# Altium schematic sheet Top.SchDoc
size 406 x 304 mm; SheetNumber: 1; SheetTotal: 10
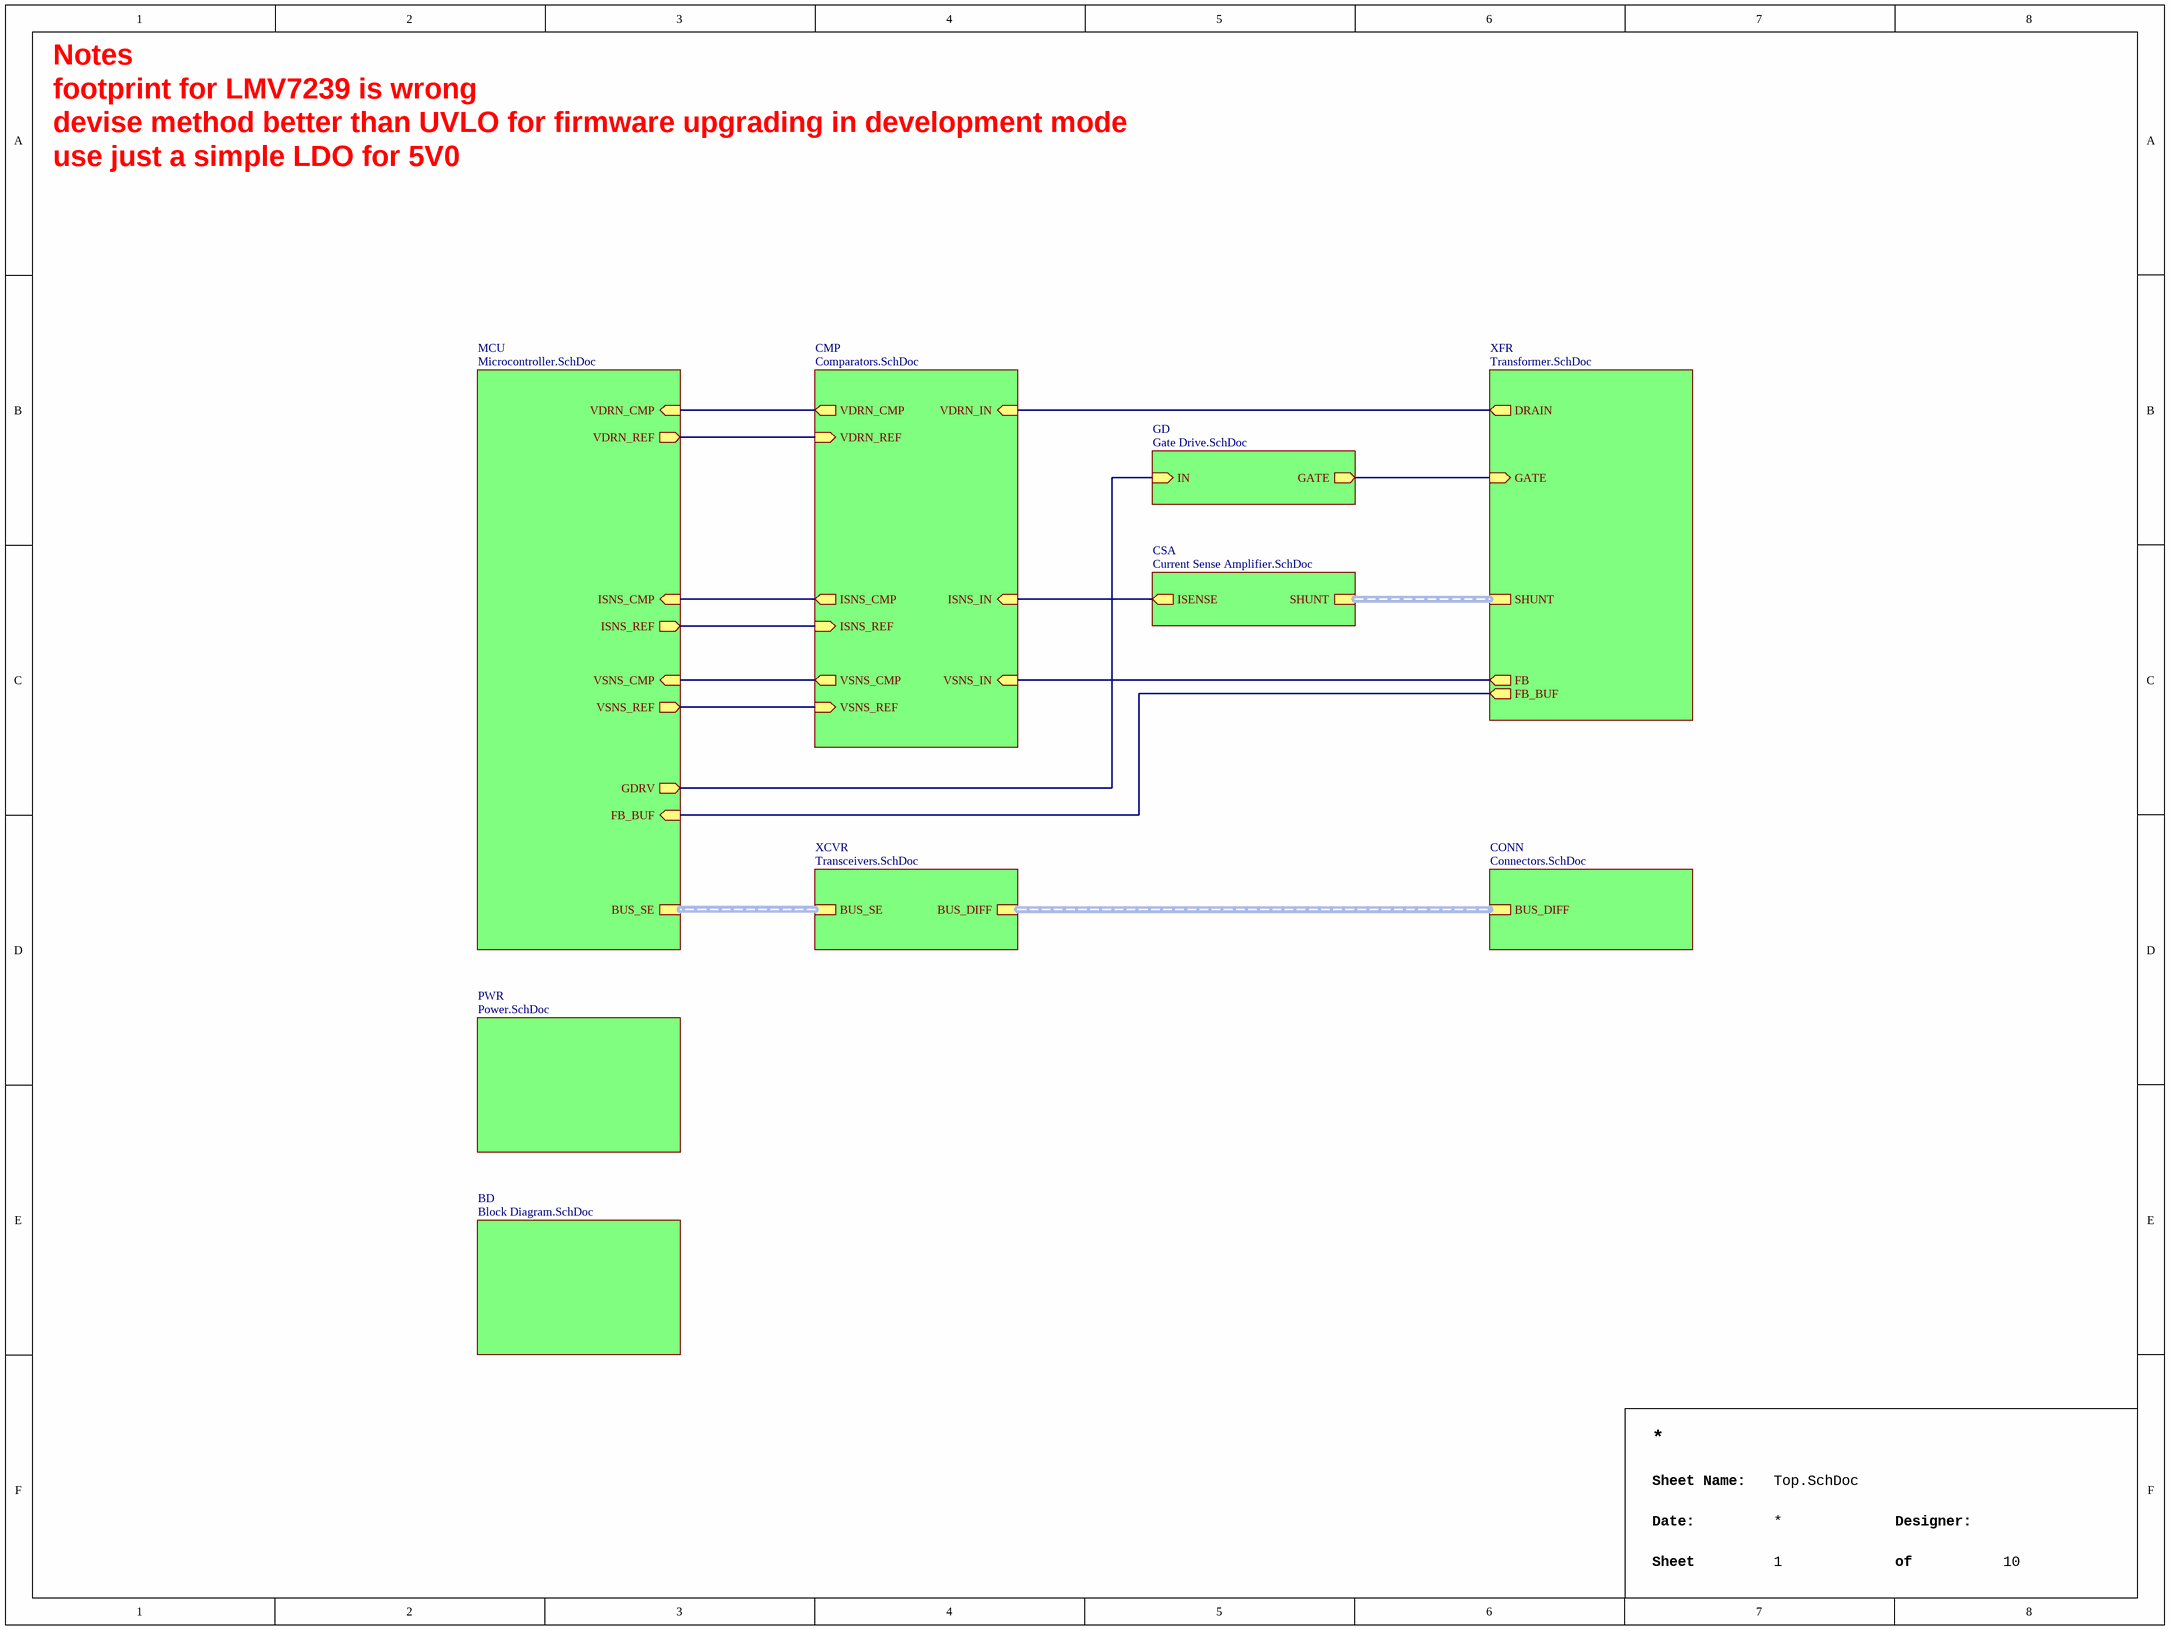
[diagram p0: Top.SchDoc]

## Sub-sheets
BD = Block Diagram.SchDoc: no entries
CMP = Comparators.SchDoc: ISNS_CMP (out), VSNS_CMP (out), VDRN_CMP (out), ISNS_REF (in), ISNS_IN (in), VSNS_REF (in), VSNS_IN (in), VDRN_REF (in), VDRN_IN (in)
CONN = Connectors.SchDoc: BUS_DIFF (harness BUS_DIFF)
CSA = Current Sense Amplifier.SchDoc: SHUNT (harness SHUNT), ISENSE (out)
GD = Gate Drive.SchDoc: GATE (out), IN (in)
MCU = Microcontroller.SchDoc: VDRN_CMP (in), VDRN_REF (out), ISNS_CMP (in), ISNS_REF (out), VSNS_CMP (in), VSNS_REF (out), BUS_SE (harness BUS_SE), GDRV (out), FB_BUF (in)
PWR = Power.SchDoc: no entries
XCVR = Transceivers.SchDoc: BUS_SE (harness BUS_SE), BUS_DIFF (harness BUS_DIFF)
XFR = Transformer.SchDoc: DRAIN (out), GATE (in), FB (out), SHUNT (harness SHUNT), FB_BUF (out)

## Nets
(unnamed): sheet XFR/DRAIN, sheet CMP/VDRN_IN
(unnamed): sheet XFR/GATE, sheet GD/GATE
(unnamed): sheet XFR/FB, sheet CMP/VSNS_IN
(unnamed): sheet XFR/FB_BUF, sheet MCU/FB_BUF
(unnamed): sheet CSA/ISENSE, sheet CMP/ISNS_IN
(unnamed): sheet GD/IN, sheet MCU/GDRV
(unnamed): sheet CMP/ISNS_CMP, sheet MCU/ISNS_CMP
(unnamed): sheet CMP/VSNS_CMP, sheet MCU/VSNS_CMP
(unnamed): sheet CMP/VDRN_CMP, sheet MCU/VDRN_CMP
(unnamed): sheet CMP/ISNS_REF, sheet MCU/ISNS_REF
(unnamed): sheet CMP/VSNS_REF, sheet MCU/VSNS_REF
(unnamed): sheet CMP/VDRN_REF, sheet MCU/VDRN_REF

## Buses and harness runs
harness sheet CONN/BUS_DIFF = sheet XCVR/BUS_DIFF
harness sheet CSA/SHUNT = sheet XFR/SHUNT
harness sheet MCU/BUS_SE = sheet XCVR/BUS_SE

## Notes on the sheet
- Notes
- footprint for LMV7239 is wrong
- devise method better than UVLO for firmware upgrading in development mode
- use just a simple LDO for 5V0
- Sheet Name:
- Date:
- Sheet
- Designer:
- of